# EAGLE board Dist_board_(1.21) (EAGLE 7.5.0), part 1 of 2
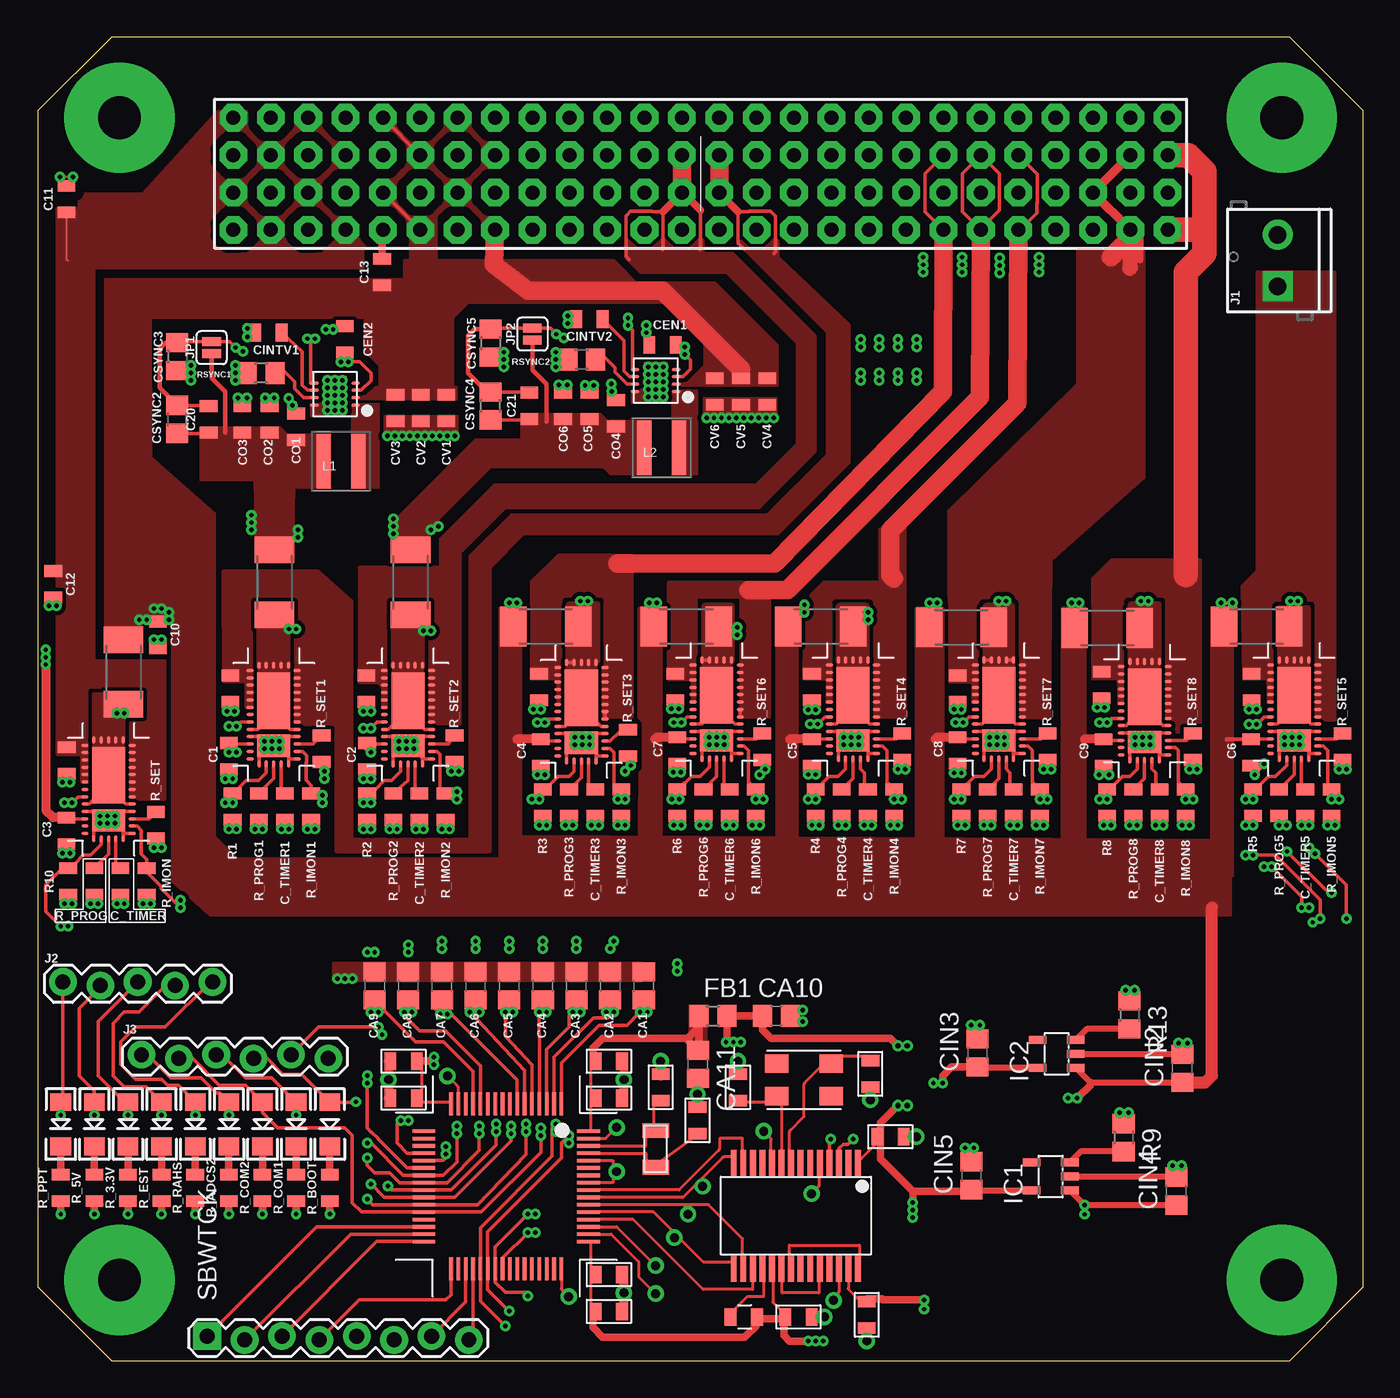
[diagram p3: board, top side]
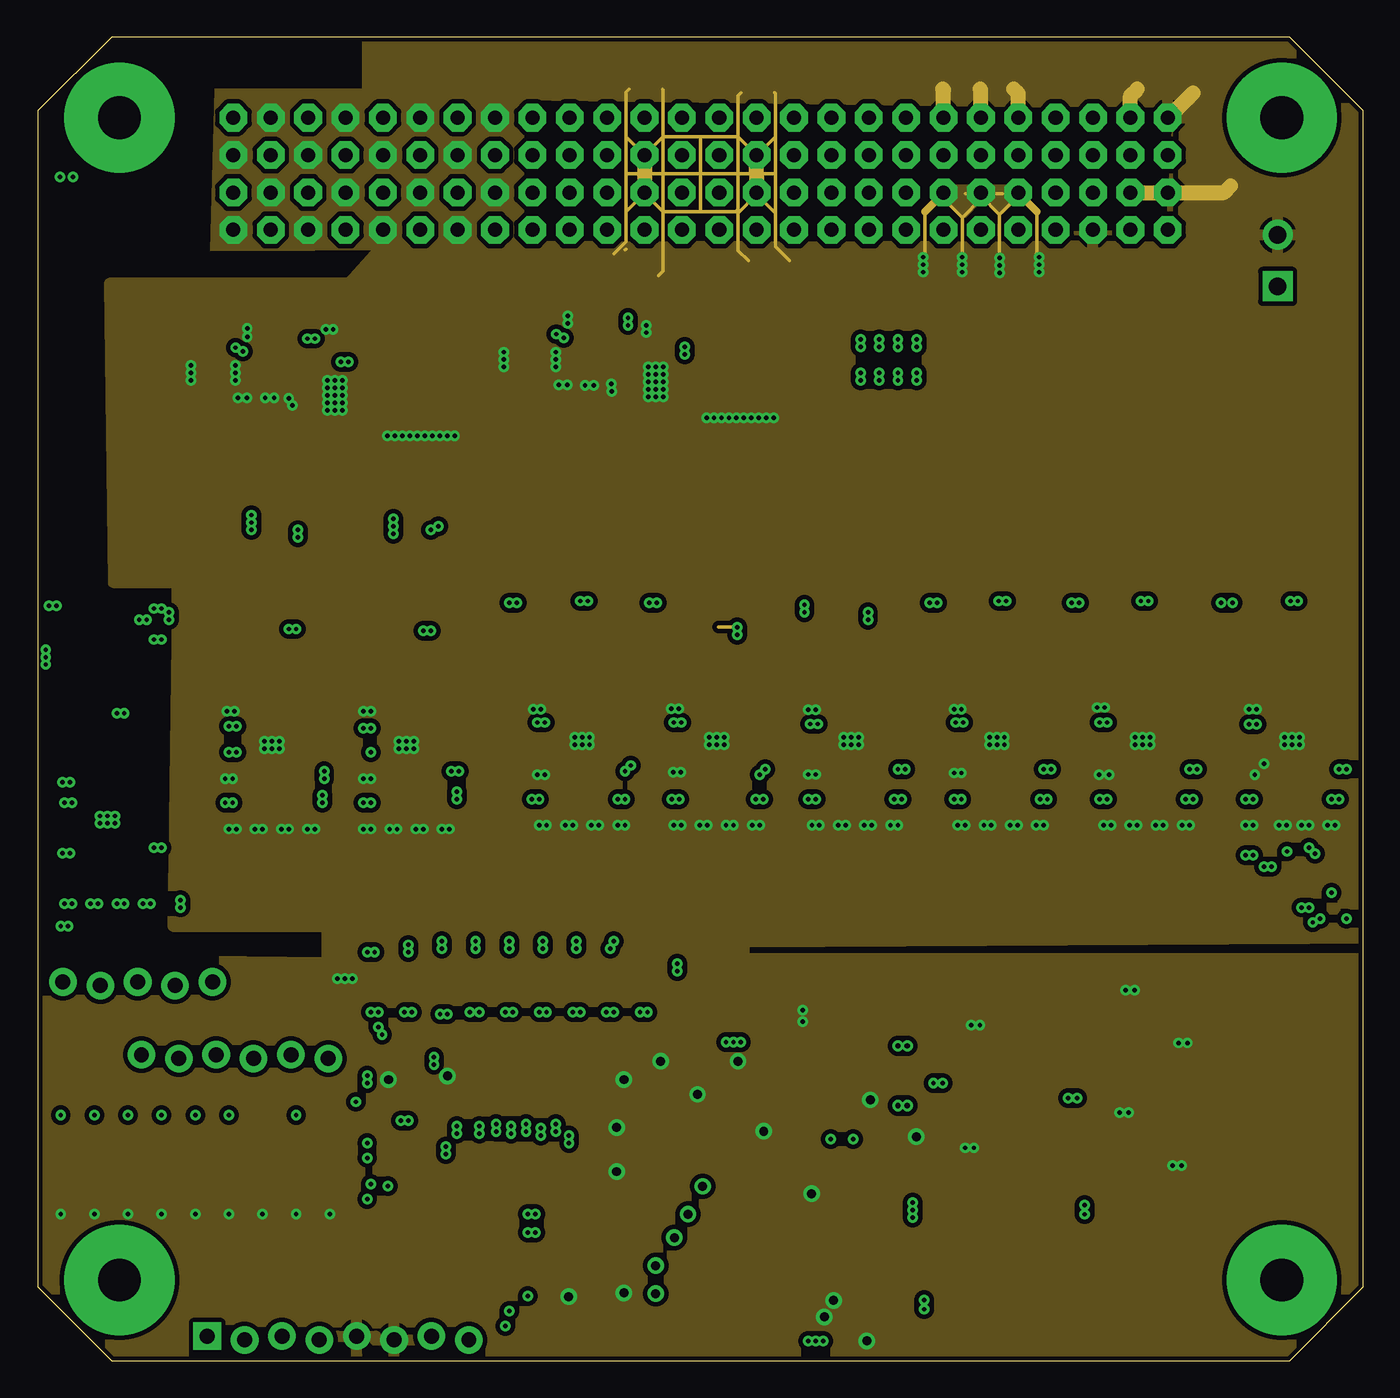
[diagram p4: board, inner layer Route2]
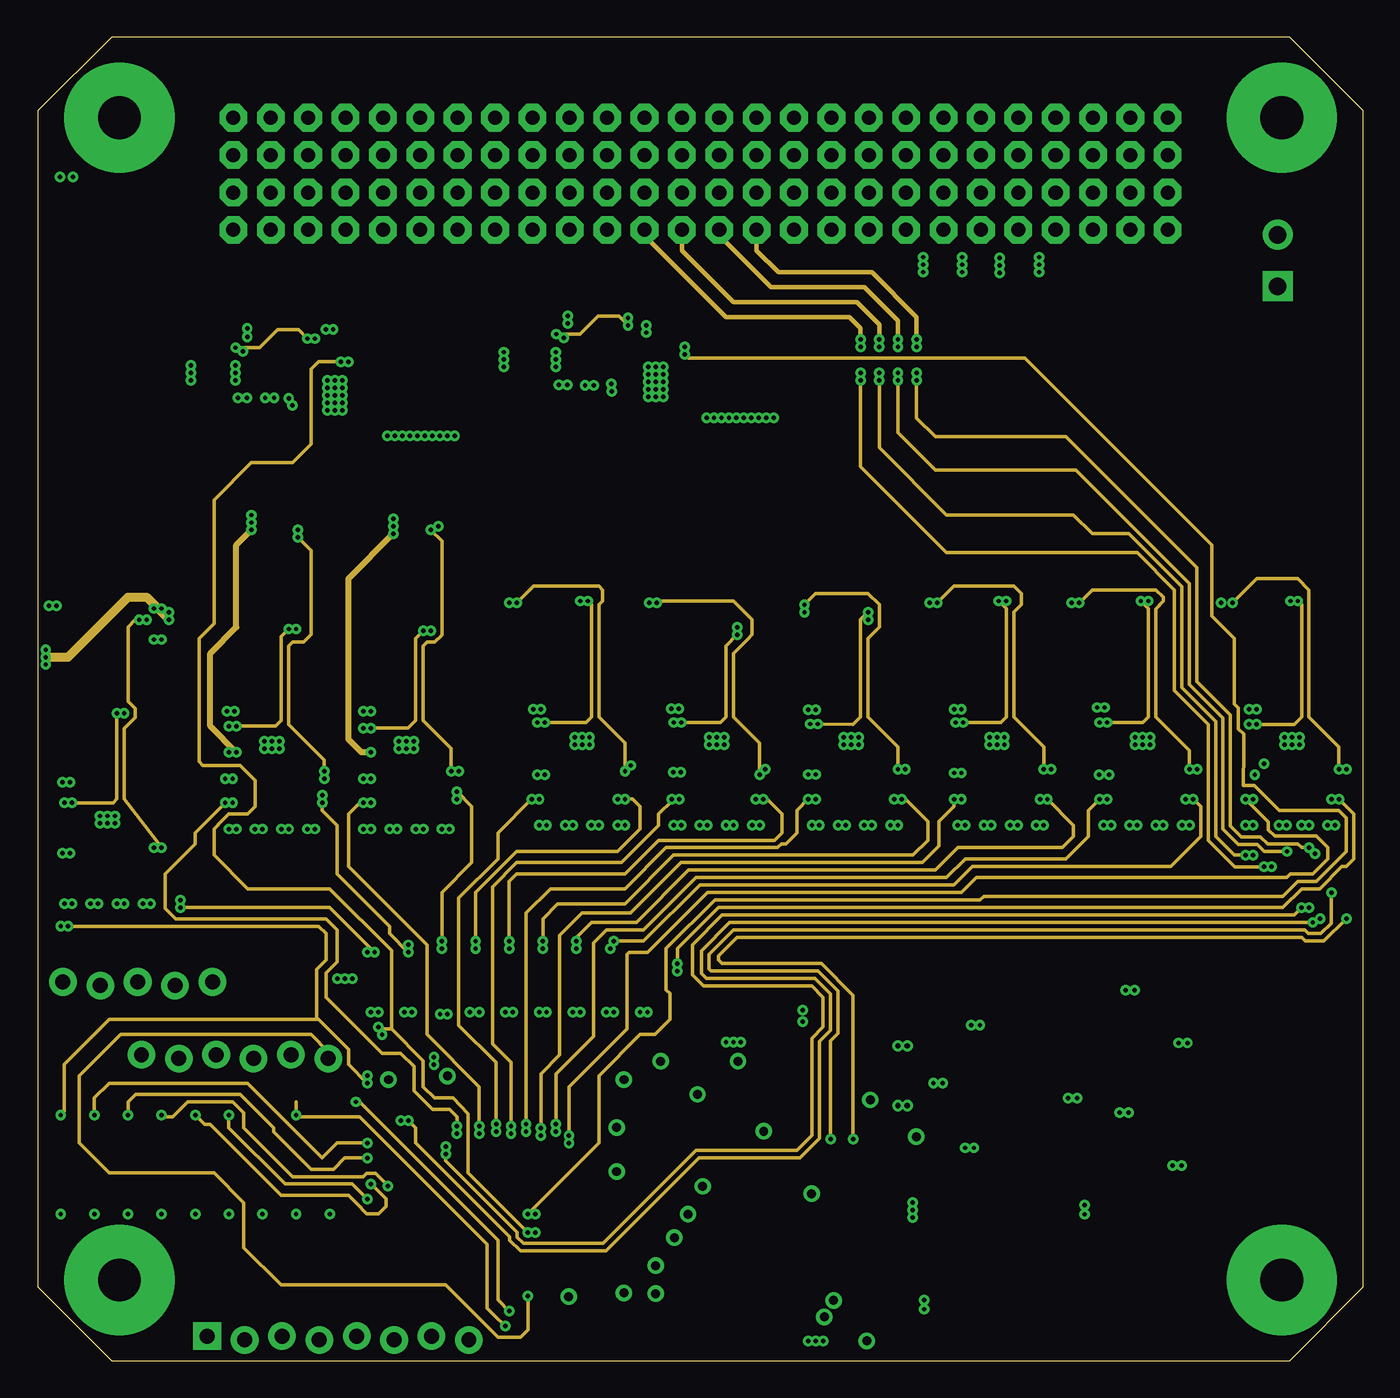
[diagram p5: board, inner layer Route3]
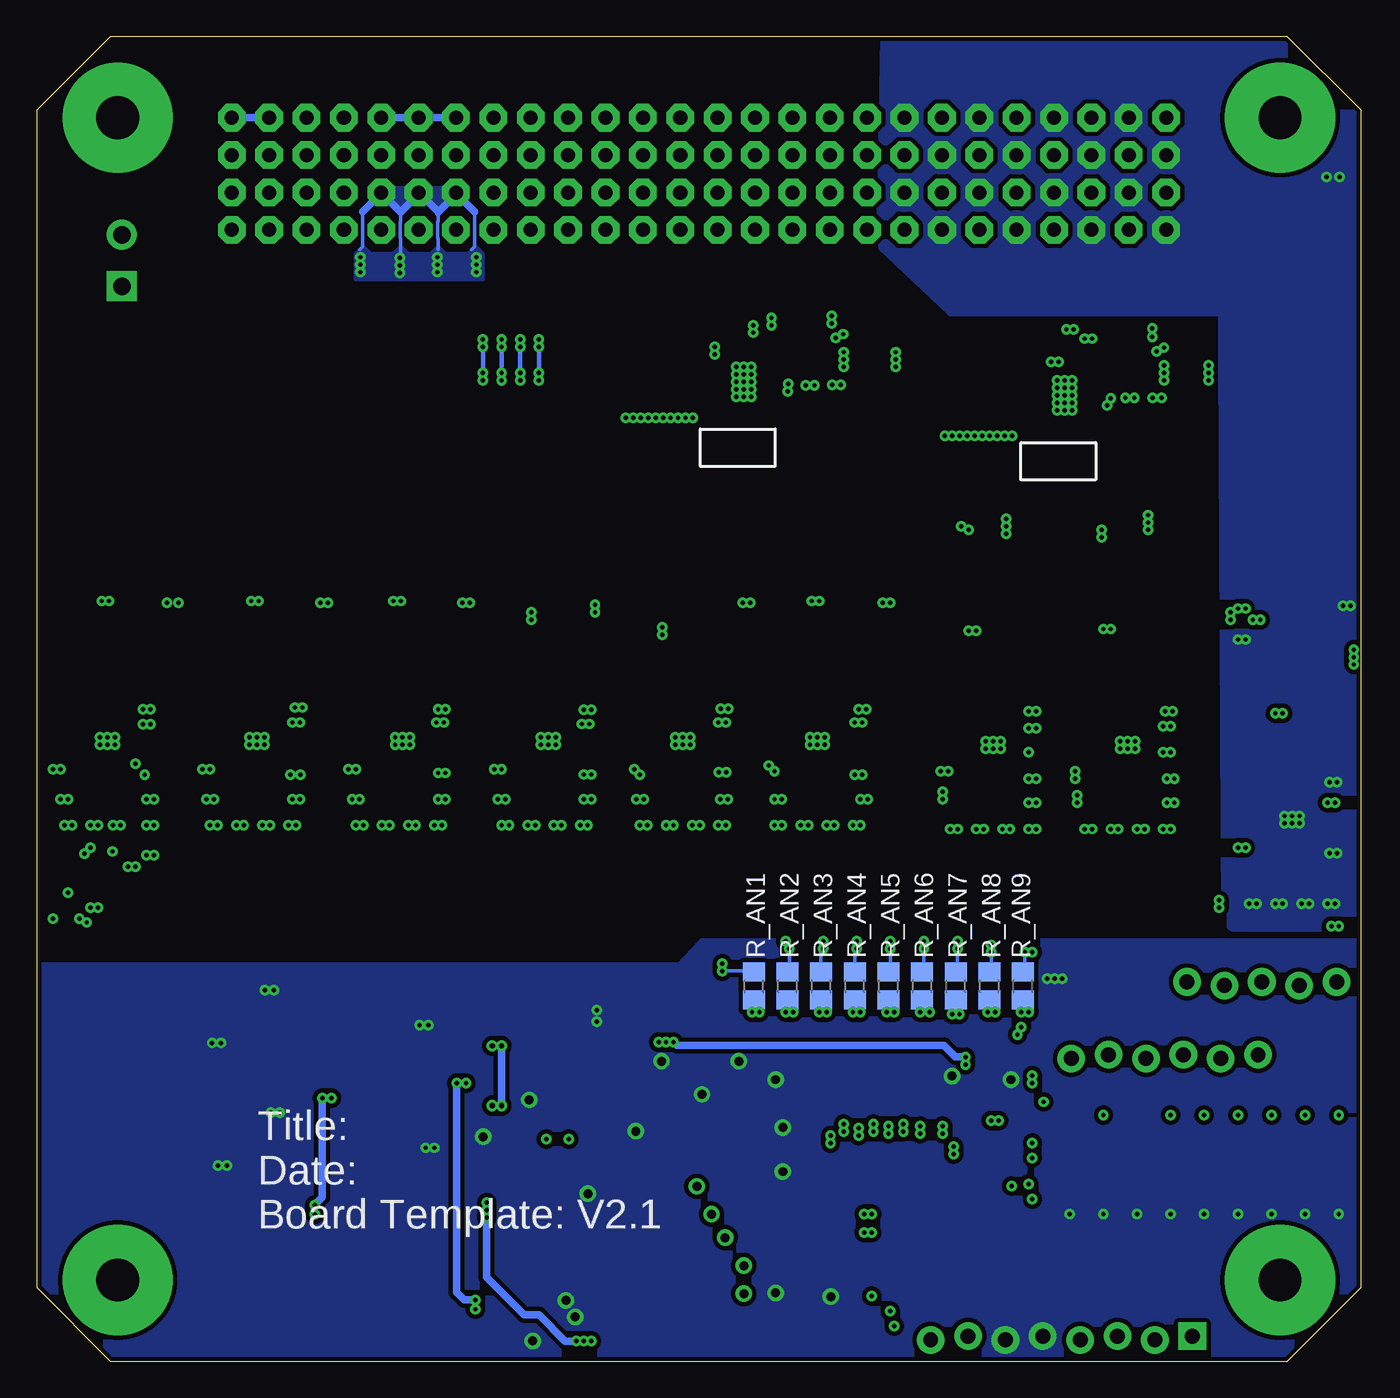
[diagram p6: board, bottom side, seen from below]

Size 90 x 90 mm. Coordinates in mm from the lower left corner, seen from the top.
Copper layers (1*2*3*16): Top 0.035mm / dielectric 1.5mm / Route2 0.035mm / dielectric 0.15mm / Route3 0.035mm / dielectric 0.2mm / Bottom 0.035mm
Design rules "default *": minimum track width 5mil, minimum drill 11mil, track to track 10mil, track to pad 10mil, pad to pad 8mil, via to via 10mil, smd to smd 0mil, copper to edge 1mil, drill to drill 8mil, minimum pad ring 10mil, minimum via ring 8mil, stop-mask expansion 4mil, vias tented up to drill 0mil, thermal gap 10mil

## Footprints (pad centres in the part's own frame; a part is rotated, then mirrored left to right if it is on the bottom)
0805 = smd 0.8 x 1.2: 1 -0.9,0; 2 0.9,0
C0805 = smd 1.3 x 1.5: 1 -0.95,0; 2 0.95,0
R0805 = smd 1.3 x 1.5: 1 -0.95,0; 2 0.95,0
LED-1206 = smd 1.2 x 1.4: A -1.5,0; C 1.5,0
SOT23-DBV = smd 0.55 x 1.2: 1 -0.95,-1.3; 2 0,-1.3; 3 0.95,-1.3; 4 0.95,1.3; 5 -0.95,1.3
SCREWTERMINAL-3.5MM-2 = drill 1.2 pad 2.032 square: 1 0,0 | drill 1.2 pad 2.032: 2 3.5,0
1X05_LOCK = drill 1.016 pad 1.88: 1 0,0.127; 2 2.54,-0.127; 3 5.08,0.127; 4 7.62,-0.127; 5 10.16,0.127
1X06_LOCK = drill 1.016 pad 1.88: 1 0,0; 2 2.54,-0.254; 3 5.08,0; 4 7.62,-0.254; 5 10.16,0; 6 12.7,-0.254
SMT-JUMPER_2_NC_PASTE_SILK = smd 0.635 x 1.27: 1 -0.406,0; 2 0.406,0
COILCRAFT = smd 0.965 x 3.708: 1 -1.182,0; 2 1.182,0
2010 = smd 1.8 x 2.7: 1 -2.2,0; 2 2.2,0
QFN-36 = smd 0.24 x 0.5: P1 -3,-1.6; P2 -2.5,-1.6; P3 -2,-1.6; P4 -1.5,-1.6; P5 -1,-1.6; P6 -0.5,-1.6; P7 0,-1.6; P8 0.5,-1.6; P9 1,-1.6; P10 1.5,-1.6; P11 2,-1.6; P12 2.5,-1.6; P13 3,-1.6; P19 3,1.6; P20 2.5,1.6; P21 2,1.6; P22 1.5,1.6; P23 1,1.6; P24 0.5,1.6; P25 0,1.6; P26 -0.5,1.6; P27 -1,1.6; P28 -1.5,1.6; P29 -2,1.6; P30 -2.5,1.6; P31 -3,1.6 | smd 0.5 x 0.24: P14 3.35,-1; P15 3.35,-0.5; P16 3.35,0; P17 3.35,0.5; P18 3.35,1; P32 -3.35,1; P33 -3.35,0.5; P34 -3.35,0; P35 -3.35,-0.5; P36 -3.35,-1 | smd 1.514 x 2.25: P$37 -2.118,0 | smd 3.836 x 2.25: P$38 0.957,0
PC104_CONNECTOR = drill 0.953 pad 1.88 octagon: P$1 -31.75,31.88; P$2 -31.75,34.42; P$3 -31.75,36.96; P$4 -31.75,39.5; P$5 -29.21,31.88; P$6 -29.21,34.42; P$7 -29.21,36.96; P$8 -29.21,39.5; P$9 -26.67,31.88; P$10 -26.67,34.42; P$11 -26.67,36.96; P$12 -26.67,39.5; P$13 -24.13,31.88; P$14 -24.13,34.42; P$15 -24.13,36.96; P$16 -24.13,39.5; P$17 -21.59,31.88; P$18 -21.59,34.42; P$19 -21.59,36.96; P$20 -21.59,39.5; P$21 -19.05,31.88; P$22 -19.05,34.42; P$23 -19.05,36.96; P$24 -19.05,39.5; P$25 -16.51,31.88; P$26 -16.51,34.42; P$27 -16.51,36.96; P$28 -16.51,39.5; P$29 -13.97,31.88; P$30 -13.97,34.42; P$31 -13.97,36.96; P$32 -13.97,39.5; P$33 -11.43,31.88; P$34 -11.43,34.42; P$35 -11.43,36.96; P$36 -11.43,39.5; P$37 -8.89,31.88; P$38 -8.89,34.42; P$39 -8.89,36.96; P$40 -8.89,39.5; P$41 -6.35,31.88; P$42 -6.35,34.42; P$43 -6.35,36.96; P$44 -6.35,39.5; P$45 -3.81,31.88; P$46 -3.81,34.42; P$47 -3.81,36.96; P$48 -3.81,39.5; P$49 -1.27,31.88; P$50 -1.27,34.42; P$51 -1.27,36.96; P$52 -1.27,39.5; P$53 1.27,31.88; P$54 1.27,34.42; P$55 1.27,36.96; P$56 1.27,39.5; P$57 3.81,31.88; P$58 3.81,34.42; P$59 3.81,36.96; P$60 3.81,39.5; P$61 6.35,31.88; P$62 6.35,34.42; P$63 6.35,36.96; P$64 6.35,39.5; P$65 8.89,31.88; P$66 8.89,34.42; P$67 8.89,36.96; P$68 8.89,39.5; P$69 11.43,31.88; P$70 11.43,34.42; P$71 11.43,36.96; P$72 11.43,39.5; P$73 13.97,31.88; P$74 13.97,34.42; P$75 13.97,36.96; P$76 13.97,39.5; P$77 16.51,31.88; P$78 16.51,34.42; P$79 16.51,36.96; P$80 16.51,39.5; P$81 19.05,31.88; P$82 19.05,34.42; P$83 19.05,36.96; P$84 19.05,39.5; P$85 21.59,31.88; P$86 21.59,34.42; P$87 21.59,36.96; P$88 21.59,39.5; P$89 24.13,31.88; P$90 24.13,34.42; P$91 24.13,36.96; P$92 24.13,39.5; P$93 26.67,31.88; P$94 26.67,34.42; P$95 26.67,36.96; P$96 26.67,39.5; P$97 29.21,31.88; P$98 29.21,34.42; P$99 29.21,36.96; P$100 29.21,39.5; P$101 31.75,31.88; P$102 31.75,34.42; P$103 31.75,36.96; P$104 31.75,39.5
BOARD_TEMPLATE = drill 2.9 pad 7.5: P$1 -39.5,39.5; P$2 -39.5,-39.5; P$3 39.5,-39.5; P$4 39.5,39.5
8-LFCSP = smd 0.6 x 0.24: P$1 -1.4,0.75; P$2 -1.4,0.25; P$3 -1.4,-0.25; P$4 -1.4,-0.75; P$5 1.4,-0.75; P$6 1.4,-0.25; P$7 1.4,0.25; P$8 1.4,0.75 | smd 1.6 x 2.44: P$9 0,0
MSP-CAN_BLOCK = smd 1.2 x 0.8: 1 -6,6.08; 2 -6,7.88; 3 -8.5,6.08; 4 -8.5,7.88; 9 -8.5,-6.08; 10 -8.5,-7.88; 11 -6,-6.08; 12 -6,-7.88; 13 8.5,6.08; 14 8.5,7.88; 15 6,6.08; 16 6,7.88; 23 8.875,18.955; 24 8.875,20.755; 25 8.875,17.045; 26 8.875,15.245; 27 -3.375,25.205; 28 -3.375,27.005 | smd 1 x 0.25: 3.3V@CAN1 -3.375,25.125; 3.3V@CAN2 8.875,18.875; 3.3V@MSP1 8.501,5.884; 3.3V@MSP2 -8.533,-5.962; 3.3V_ANALOG@MSP2 -8.482,5.904 | smd 0.8 x 1.2: 5 -5.83,10.5; 6 -7.63,10.5; 7 -3.58,13; 8 -5.38,13; 17 -8.545,24.75; 18 -6.745,24.75; 19 -5.83,15.75; 20 -7.63,15.75; 21 7.83,24.5; 22 9.63,24.5 | smd 0.25 x 1: 5V 7.65,24.5 | smd 1.75 x 0.4: CANH -1.6,21.96; CANL -1.6,22.61; P$65 -1.6,23.91; P$66 -1.6,23.26; P$69 -1.6,21.31; P$70 -1.6,20.66; P$71 -1.6,20.01; P$72 -1.6,19.36; P$73 -1.6,18.71; P$74 -1.6,18.06; P$75 -1.6,17.41; P$76 -1.6,16.76; P$77 -1.6,16.11; P$78 -1.6,15.46; P$79 5.6,15.46; P$80 5.6,16.11; P$81 5.6,16.76; P$82 5.6,17.41; P$83 5.6,18.06; P$84 5.6,18.71; P$85 5.6,19.36; P$86 5.6,20.01; P$87 5.6,20.66; P$88 5.6,21.31; P$89 5.6,21.96; P$90 5.6,22.61; P$91 5.6,23.26; P$92 5.6,23.91 | drill 0.61: GND@1 -3.375,27.875; GND@2 -5.875,24.75; GND@3 -3.75,17.5; GND@4 0.5,20.75; GND@5 -8.5,15.75; GND@7 -8.5,10.5; GND@8 -7.25,8; GND@9 -4,7.5; GND@10 -1,7.5; GND@11 7.75,22.25; GND@12 10.5,24.5; GND@13 8.875,21.625; GND@14 7.25,8; GND@15 7.5,4.25; GND@16 -7.5,-4; GND@17 -7.25,-8; GND@26 -6.25,13; P2.4_SPI-CS2 5.397,10.16; P2.7_SPI-CS3 7.303,10.16; P5.4_SPI-MOSI 3.487,11.434; P5.5_SPI-MISO 1.9,12.354; P5.6_SPI-CLK 0,13.348 | smd 1.55 x 0.25: P1.0_A0 -5.6,3.75; P1.1_A1 -5.6,3.25; P1.2_A2 -5.6,2.75; P1.3_A3 -5.6,-1.75; P1.4_A4 -5.6,-2.25; P1.5_A5 -5.6,-2.75; P1.6_GPIO/PWM 5.6,-0.75; P1.7_GPIO/PWM 5.6,-0.25; P2.1_RXD 5.6,-3.75; P2.2_GPIO/PWM 5.6,-3.25; P3.0_A12 -5.6,2.25; P3.1_A13 -5.6,1.75; P3.2_A14 -5.6,1.25; P3.3_A15 -5.6,0.75; P3.4_GPIO_DEBUG 5.6,-2.75; P3.5_GPIO_DEBUG 5.6,-2.25; P3.6_GPIO/PWM 5.6,-1.75; P3.7_GPIO/PWM 5.6,-1.25; P5.0_I2C-SDA-1 5.6,0.25; P5.1_I2C-SCL-1 5.6,0.75; P7.0_I2C-SDA-2 -5.6,-0.25; P7.1_I2C-SCL-2 -5.6,-0.75; P$8 -5.6,0.25; P$11 -5.6,-1.25; P$15 -5.6,-3.25; P$16 -5.6,-3.75; P$43 5.6,1.25; P$44 5.6,1.75; P$45 5.6,2.25; P$46 5.6,2.75; P$47 5.6,3.25; P$48 5.6,3.75 | smd 0.25 x 1.55: P2.0_TXD 3.75,-5.6; P2.5_GPIO 1.75,-5.6; P2.6_GPIO/PWM 2.25,-5.6; P4.0_GPIO -0.25,-5.6; P4.1_GPIO 0.25,-5.6; P4.2_GPIO 0.75,-5.6; P4.3_GPIO 1.25,-5.6; P7.2_SYNC1 -1.75,-5.6; P7.3_GPIO -1.25,-5.6; P7.4_GPIO -0.75,-5.6; P$17 -3.75,-5.6; P$18 -3.25,-5.6; P$19 -2.75,-5.6; P$49 3.75,5.6; P$50 3.25,5.6; P$51 2.75,5.6; P$52 2.25,5.6; P$53 1.75,5.6; P$54 1.25,5.6; P$55 0.75,5.6; P$56 0.25,5.6; P$57 -0.25,5.6; P$58 -0.75,5.6; P$59 -1.25,5.6; P$60 -1.75,5.6; P$61 -2.25,5.6; P$62 -2.75,5.6; P$63 -3.25,5.6; P$64 -3.75,5.6; PJ.3_SYNC2 -2.25,-5.6; SBWTCK 2.75,-5.6; SBWTDIO 3.25,-5.6 | smd 1 x 1.8: P$93 -3.79,10.16; P$94 -1.29,10.16 | smd 1.25 x 1.6: P$104 -6.13,18.38; P$105 -6.13,22.08; P$106 -8.33,22.08; P$107 -8.33,18.38
1X08_CONNECTOR = drill 1.016 pad 1.88: 2 2.54,-0.127; 3 5.08,0.127; 4 7.62,-0.127; 5 10.16,0.127; 6 12.7,-0.127; 7 15.24,0.127; 8 17.78,-0.127 | drill 1.016 pad 1.88 square: SBWTCK 0,0.127

## Placement (x,y rotation side)
C1  [0805]  12.95,41.11 270 top
C2  [0805]  22.34,41.11 270 top
C3  [0805]  1.9,36.03 270 top
C4  [0805]  34.15,41.37 270 top
C5  [0805]  52.57,41.37 270 top
C6  [0805]  82.41,41.37 270 top
C7  [0805]  43.43,41.49 270 top
C8  [0805]  62.48,41.49 270 top
C9  [0805]  72.38,41.37 270 top
C10  [0805]  8.12,49.37 270 top
C11  [0805]  1.9,78.96 90 top
C12  [0805]  1.01,52.8 270 top
C13  [0805]  23.36,74.01 90 top
C20  DNI  [0805]  11.57,64 90 top
C21  DNI  [0805]  33.37,64.91 90 top
C_OUT  0.1u  [0805]  1.93,40.81 270 top
C_OUT1  0.1u  [0805]  13.05,45.69 270 top
C_OUT2  0.1u  [0805]  22.3,45.69 270 top
C_OUT3  0.1u  [0805]  34.03,45.81 270 top
C_OUT4  0.1u  [0805]  52.57,45.81 270 top
C_OUT5  0.1u  [0805]  82.44,45.81 270 top
C_OUT6  0.1u  [0805]  43.27,45.81 270 top
C_OUT7  0.1u  [0805]  62.48,45.69 270 top
C_OUT8  0.1u  [0805]  72.25,45.94 270 top
C_TIMER  3.9n  [0805]  5.58,32.6 270 top
C_TIMER1  3.9n  [0805]  16.76,37.68 270 top
C_TIMER2  3.9n  [0805]  25.9,37.68 270 top
C_TIMER3  3.9n  [0805]  37.84,37.94 270 top
C_TIMER4  3.9n  [0805]  56.38,37.94 270 top
C_TIMER5  3.9n  [0805]  86.1,37.94 270 top
C_TIMER6  3.9n  [0805]  46.98,37.94 270 top
C_TIMER7  3.9n  [0805]  66.29,37.94 270 top
C_TIMER8  3.9n  [0805]  76.19,37.94 270 top
CA1  1uF  [C0805]  41.14,25.49 90 top
CA2  1uF  [C0805]  38.85,25.49 90 top
CA3  1uF  [C0805]  36.57,25.49 90 top
CA4  1uF  [C0805]  34.28,25.49 90 top
CA5  1uF  [C0805]  32,25.49 90 top
CA6  1uF  [C0805]  29.71,25.49 90 top
CA7  1uF  [C0805]  27.42,25.49 90 top
CA8  1uF  [C0805]  25.14,25.49 90 top
CA9  1uF  [C0805]  22.85,25.49 90 top
CA10  1uF  [C0805]  50.16,23.46 0 top
CA11  10uF  [C0805]  44.82,20.16 270 top
CEN1  0.1uF  [0805]  42.41,69.05 180 top
CEN2  0.1uF  [0805]  20.82,69.43 90 top
CIN2  1uF  [C0805]  77.73,19.89 90 top
CIN3  2.2uF  [C0805]  63.81,20.94 90 top
CIN4  1uF  [C0805]  77.32,11.56 90 top
CIN5  2.2uF  [C0805]  63.41,12.61 90 top
CINTV1  4.7uF  [0805]  15.64,69.89 180 top
CINTV2  4.7uF  [0805]  37.43,70.81 180 top
CO1  0.1uF  [0805]  17.52,63.49 90 top
CO2  1.0uF  [0805]  15.71,64 90 top
CO3  10uF  [0805]  13.86,64 90 top
CO4  0.1uF  [0805]  39.26,64.41 90 top
CO5  1.0uF  [0805]  37.46,64.91 90 top
CO6  10uF  [0805]  35.65,64.91 90 top
CSYNC2  DNI  [R0805]  9.44,64 90 top
CSYNC3  DNI  [R0805]  9.44,68.27 270 top
CSYNC4  DNI  [R0805]  30.73,64.91 90 top
CSYNC5  DNI  [R0805]  30.73,69.18 270 top
CV1  10uF  [0805]  27.73,64.76 270 top
CV2  1.0uF  [0805]  26,64.76 270 top
CV3  0.1uF  [0805]  24.27,64.76 270 top
CV4  10uF  [0805]  49.52,65.88 270 top
CV5  1.0uF  [0805]  47.74,65.88 270 top
CV6  0.1uF  [0805]  45.97,65.88 270 top
D1  [LED-1206]  1.52,16.09 270 top
D2  [LED-1206]  3.8,16.09 270 top
D3  [LED-1206]  6.09,16.09 270 top
D4  [LED-1206]  8.37,16.09 270 top
D5  [LED-1206]  12.95,16.09 270 top
D6  [LED-1206]  19.8,16.09 270 top
D7  [LED-1206]  10.66,16.09 270 top
D8  [LED-1206]  15.23,16.09 270 top
D9  [LED-1206]  17.52,16.09 270 top
FB1  2.5 nH  [R0805]  45.84,23.46 0 top
IC1  TPS77001  [SOT23-DBV]  68.79,12.54 90 top
IC2  TPS77001  [SOT23-DBV]  69.2,20.88 90 top
J1  [SCREWTERMINAL-3.5MM-2]  84.22,73.04 90 top
J2  [1X05_LOCK]  1.67,25.65 0 top
J3  [1X06_LOCK]  7,20.82 0 top
JP1  JUMPER-SMT_2_NC_PASTE_SILK  [SMT-JUMPER_2_NC_PASTE_SILK]  11.78,68.88 90 top
JP2  JUMPER-SMT_2_NC_PASTE_SILK  [SMT-JUMPER_2_NC_PASTE_SILK]  33.57,69.79 90 top
L1  1 mH  [COILCRAFT]  20.57,61.15 0 top
L2  1 mH  [COILCRAFT]  42.36,62.07 0 top
R1  100k  [0805]  13.2,37.68 90 top
R2  100k  [0805]  22.34,37.68 90 top
R3  100k  [0805]  34.28,37.94 90 top
R4  100k  [0805]  52.82,37.94 90 top
R5  100k  [0805]  82.54,37.94 90 top
R6  100k  [0805]  43.43,37.94 90 top
R7  100k  [0805]  62.73,37.94 90 top
R8  100k  [0805]  72.64,37.94 90 top
R9  10k  [R0805]  73.75,15.19 270 top
R10  100k  [0805]  2.02,32.6 90 top
R13  10k  [R0805]  74.15,23.52 270 top
R_3.3V  330  [0805]  6.09,11.78 90 top
R_5V  330  [0805]  3.8,11.78 90 top
R_ADCS2  330  [0805]  12.95,11.78 90 top
R_AN1  5  [R0805]  41.27,25.49 90 bottom
R_AN2  5  [R0805]  38.98,25.49 90 bottom
R_AN3  5  [R0805]  36.69,25.49 90 bottom
R_AN4  5  [R0805]  34.41,25.49 90 bottom
R_AN5  5  [R0805]  32.12,25.49 90 bottom
R_AN6  5  [R0805]  29.84,25.49 90 bottom
R_AN7  5  [R0805]  27.55,25.49 90 bottom
R_AN8  5  [R0805]  25.26,25.49 90 bottom
R_AN9  5  [R0805]  22.98,25.49 90 bottom
R_BOOT  330  [0805]  19.8,11.78 90 top
R_COM1  330  [0805]  17.52,11.78 90 top
R_COM2  330  [0805]  15.23,11.78 90 top
R_EST  330  [0805]  8.37,11.78 90 top
R_IMON  42.2k  [0805]  7.36,32.6 90 top
R_IMON1  42.2k  [0805]  18.53,37.68 90 top
R_IMON2  42.2k  [0805]  27.68,37.68 90 top
R_IMON3  42.2k  [0805]  39.62,37.94 90 top
R_IMON4  42.2k  [0805]  58.16,37.94 90 top
R_IMON5  42.2k  [0805]  87.88,37.94 90 top
R_IMON6  42.2k  [0805]  48.76,37.94 90 top
R_IMON7  42.2k  [0805]  68.06,37.94 90 top
R_IMON8  42.2k  [0805]  77.97,37.94 90 top
R_PPT  330  [0805]  1.52,11.78 90 top
R_PROG  4.99k  [0805]  3.8,32.6 90 top
R_PROG1  4.99k  [0805]  14.98,37.68 90 top
R_PROG2  4.99k  [0805]  24.12,37.68 90 top
R_PROG3  4.99k  [0805]  36.06,37.94 90 top
R_PROG4  4.99k  [0805]  54.6,37.94 90 top
R_PROG5  4.99k  [0805]  84.32,37.94 90 top
R_PROG6  4.99k  [0805]  45.2,37.94 90 top
R_PROG7  4.99k  [0805]  64.51,37.94 90 top
R_PROG8  4.99k  [0805]  74.41,37.94 90 top
R_RAHS  330  [0805]  10.66,11.78 90 top
R_SENSE  0.002  [2010]  5.78,46.84 270 top
R_SENSE1  0.002  [2010]  16.04,52.93 270 top
R_SENSE2  0.002  [2010]  25.29,52.93 270 top
R_SENSE3  0.002  [2010]  34.48,49.93 0 top
R_SENSE4  0.002  [2010]  53.17,49.93 0 top
R_SENSE5  0.002  [2010]  82.79,49.93 0 top
R_SENSE6  0.002  [2010]  44.03,49.93 0 top
R_SENSE7  0.002  [2010]  62.73,49.88 0 top
R_SENSE8  0.002  [2010]  72.63,49.83 0 top
R_SET  1k  [0805]  7.99,36.41 270 top
R_SET1  1k  [0805]  19.24,41.62 270 top
R_SET2  1k  [0805]  28.29,41.62 270 top
R_SET3  1k  [0805]  40.07,42 270 top
R_SET4  1k  [0805]  58.69,41.75 270 top
R_SET5  1k  [0805]  88.64,41.75 270 top
R_SET6  1k  [0805]  49.19,41.75 270 top
R_SET7  1k  [0805]  68.6,41.75 270 top
R_SET8  1k  [0805]  78.45,41.75 270 top
RSYNC1  1k  [R0805]  15.13,67.15 180 top
RSYNC2  1k  [R0805]  36.92,68.06 180 top
U$1  TI_SWITCH_TPS24750  [QFN-36]  4.77,38.85 90 top
U$2  PC104_CONNECTOR  [PC104_CONNECTOR]  45,45 0 top
U$3  BOARD_TEMPLATE_(V2.1)  [BOARD_TEMPLATE]  45,45 0 top
U$5  TI_SWITCH_TPS24750  [QFN-36]  15.99,43.93 90 top
U$6  TI_SWITCH_TPS24750  [QFN-36]  25.11,43.93 90 top
U$7  TI_SWITCH_TPS24750  [QFN-36]  36.9,44.14 90 top
U$8  TI_SWITCH_TPS24750  [QFN-36]  55.36,44.29 90 top
U$9  TI_SWITCH_TPS24750  [QFN-36]  85.34,44.29 90 top
U$10  TI_SWITCH_TPS24750  [QFN-36]  46.09,44.29 90 top
U$11  TI_SWITCH_TPS24750  [QFN-36]  65.27,44.29 90 top
U$12  TI_SWITCH_TPS24750  [QFN-36]  75.18,44.19 90 top
U$13  LINEAR_BUCK_LTC3624  [8-LFCSP]  20.16,65.73 180 top
U$14  LINEAR_BUCK_LTC3624  [8-LFCSP]  41.95,66.64 180 top
U$15  MSP-CAN_BLOCK  [MSP-CAN_BLOCK]  31.79,11.88 270 top
U$16  PROGRAM/DEBUG_PORT  [1X08_CONNECTOR]  11.47,1.57 0 top